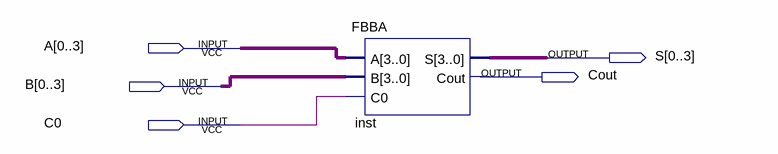
[diagram p0: schematic sheet]
// Quartus schematic Block_4BBA.bdf as structural Verilog: 1 symbols, 5 pins
module Block_4BBA (
  input  [0:3] A,
  input  [0:3] B,
  input  C0,
  output [0:3] S,
  output Cout
);

  FBBA inst (.A(A), .B(B), .C0(C0), .S(S));  // open: Cout
endmodule
